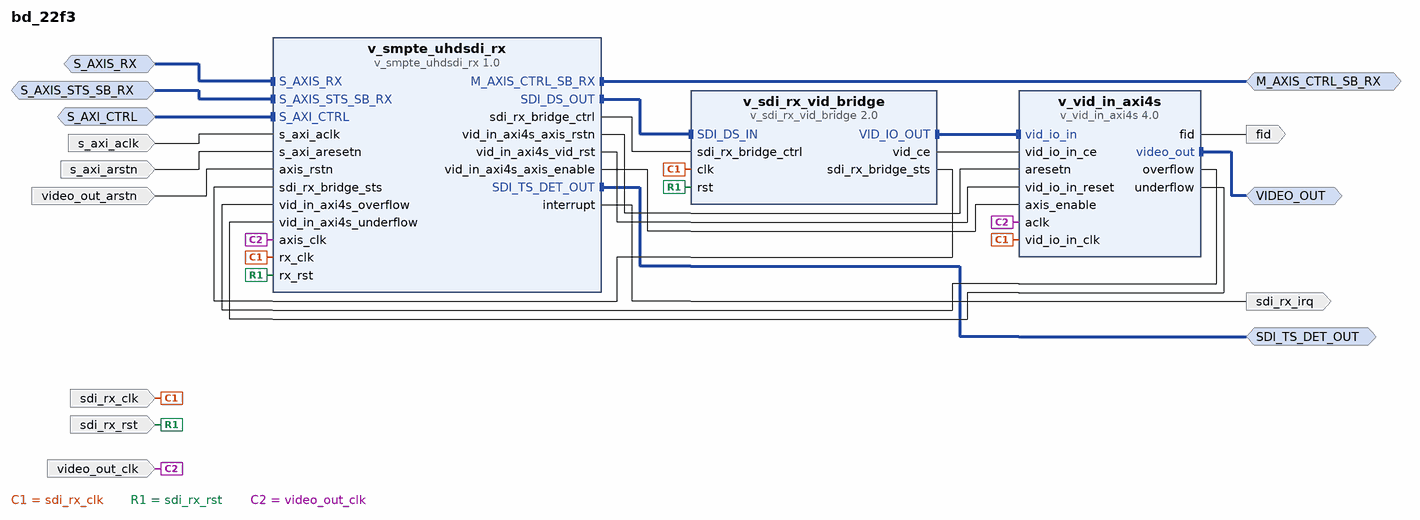
[diagram p0: block diagram of the top level]
# Vivado block design bd_22f3, xczu7ev-fbvb900-1-i, Vivado 2018.2
create_bd_design bd_22f3

create_bd_intf_port -mode Slave -vlnv xilinx.com:interface:axis_rtl:1.0 S_AXIS_RX
create_bd_intf_port -mode Master -vlnv xilinx.com:interface:axis_rtl:1.0 M_AXIS_CTRL_SB_RX
create_bd_intf_port -mode Slave -vlnv xilinx.com:interface:axis_rtl:1.0 S_AXIS_STS_SB_RX
create_bd_intf_port -mode Master -vlnv xilinx.com:interface:sdi_native_rtl:2.0 SDI_TS_DET_OUT
create_bd_intf_port -mode Master -vlnv xilinx.com:interface:axis_rtl:1.0 VIDEO_OUT
set_property -dict [list \
  CONFIG.TDATA_NUM_BYTES 8 \
  CONFIG.LAYERED_METADATA {xilinx.com:interface:datatypes:1.0 {TDATA {datatype {name {attribs {resolve_type immediate dependency {} format string minimum {} maximum {}} value xilinx.com:video:G_B_R_444:1.0} bitwidth {attribs {resolve_type automatic dependency {} format long minimum {} maximum {}} value 30} bitoffset {attribs {resolve_type immediate dependency {} format long minimum {} maximum {}} value 0} array_type {name {attribs {resolve_type immediate dependency {} format string minimum {} maximum {}} value rows} size {attribs {resolve_type generated dependency active_rows format long minimum {} maximum {}} value 1} stride {attribs {resolve_type generated dependency active_rows_stride format long minimum {} maximum {}} value 32} datatype {name {attribs {resolve_type immediate dependency {} format string minimum {} maximum {}} value {}} bitwidth {attribs {resolve_type automatic dependency {} format long minimum {} maximum {}} value 30} bitoffset {attribs {resolve_type immediate dependency {} format long minimum {} maximum {}} value 0} array_type {name {attribs {resolve_type immediate dependency {} format string minimum {} maximum {}} value cols} size {attribs {resolve_type generated dependency active_cols format long minimum {} maximum {}} value 1} stride {attribs {resolve_type generated dependency active_cols_stride format long minimum {} maximum {}} value 32} datatype {name {attribs {resolve_type immediate dependency {} format string minimum {} maximum {}} value {}} bitwidth {attribs {resolve_type automatic dependency {} format long minimum {} maximum {}} value 30} bitoffset {attribs {resolve_type immediate dependency {} format long minimum {} maximum {}} value 0} struct {field_G {name {attribs {resolve_type immediate dependency {} format string minimum {} maximum {}} value G} enabled {attribs {resolve_type immediate dependency {} format bool minimum {} maximum {}} value true} datatype {name {attribs {resolve_type immediate dependency {} format string minimum {} maximum {}} value {}} bitwidth {attribs {resolve_type generated dependency video_data_width format long minimum {} maximum {}} value 10} bitoffset {attribs {resolve_type immediate dependency {} format long minimum {} maximum {}} value 0} integer {signed {attribs {resolve_type immediate dependency {} format bool minimum {} maximum {}} value true}}}} field_B {name {attribs {resolve_type immediate dependency {} format string minimum {} maximum {}} value B} enabled {attribs {resolve_type generated dependency video_comp1_enabled format bool minimum {} maximum {}} value true} datatype {name {attribs {resolve_type immediate dependency {} format string minimum {} maximum {}} value {}} bitwidth {attribs {resolve_type generated dependency video_data_width format long minimum {} maximum {}} value 10} bitoffset {attribs {resolve_type generated dependency video_comp1_offset format long minimum {} maximum {}} value 10} integer {signed {attribs {resolve_type immediate dependency {} format bool minimum {} maximum {}} value true}}}} field_R {name {attribs {resolve_type immediate dependency {} format string minimum {} maximum {}} value R} enabled {attribs {resolve_type generated dependency video_comp2_enabled format bool minimum {} maximum {}} value true} datatype {name {attribs {resolve_type immediate dependency {} format string minimum {} maximum {}} value {}} bitwidth {attribs {resolve_type generated dependency video_data_width format long minimum {} maximum {}} value 10} bitoffset {attribs {resolve_type generated dependency video_comp2_offset format long minimum {} maximum {}} value 20} integer {signed {attribs {resolve_type immediate dependency {} format bool minimum {} maximum {}} value true}}}}}}}}}}} TDATA_WIDTH 32}} \
] [get_bd_intf_ports VIDEO_OUT]
create_bd_intf_port -mode Slave -vlnv xilinx.com:interface:aximm_rtl:1.0 S_AXI_CTRL
set_property -dict {CONFIG.DATA_WIDTH 32 CONFIG.ADDR_WIDTH 16} [get_bd_intf_ports S_AXI_CTRL]
create_bd_port -dir I -type clk sdi_rx_clk
set_property -dict {CONFIG.ASSOCIATED_RESET sdi_rx_rst} [get_bd_ports sdi_rx_clk]
create_bd_port -dir I -type rst sdi_rx_rst
create_bd_port -dir O fid
create_bd_port -dir I -type clk video_out_clk
set_property -dict {CONFIG.ASSOCIATED_RESET video_out_arstn} [get_bd_ports video_out_clk]
create_bd_port -dir I -type rst video_out_arstn
set_property -dict {CONFIG.POLARITY ACTIVE_LOW} [get_bd_ports video_out_arstn]
create_bd_port -dir O -type intr sdi_rx_irq
create_bd_port -dir I -type clk s_axi_aclk
set_property -dict {CONFIG.ASSOCIATED_RESET s_axi_arstn} [get_bd_ports s_axi_aclk]
create_bd_port -dir I -type rst s_axi_arstn
set_property -dict {CONFIG.POLARITY ACTIVE_LOW} [get_bd_ports s_axi_arstn]

create_bd_cell -type ip -vlnv xilinx.com:ip:v_smpte_uhdsdi_rx:1.0 v_smpte_uhdsdi_rx
set_property -dict [list \
  CONFIG.C_LINE_RATE 12G_SDI_8DS \
  CONFIG.C_ADV_FEATURE false \
  CONFIG.C_AXI4LITE_ENABLE true \
  CONFIG.C_INCLUDE_VID_OVER_AXI true \
  CONFIG.C_INCLUDE_SDI_BRIDGE true \
  CONFIG.C_INCLUDE_RX_EDH_PROCESSOR true \
] [get_bd_cells v_smpte_uhdsdi_rx]
create_bd_cell -type ip -vlnv xilinx.com:ip:v_sdi_rx_vid_bridge:2.0 v_sdi_rx_vid_bridge
set_property -dict [list \
  CONFIG.C_PIXELS_PER_CLOCK 2 \
  CONFIG.C_INCLUDE_3G_SDI_BRIDGE true \
  CONFIG.C_INCLUDE_12G_SDI_BRIDGE true \
] [get_bd_cells v_sdi_rx_vid_bridge]
create_bd_cell -type ip -vlnv xilinx.com:ip:v_vid_in_axi4s:4.0 v_vid_in_axi4s
set_property -dict [list \
  CONFIG.C_PIXELS_PER_CLOCK 2 \
  CONFIG.C_M_AXIS_VIDEO_DATA_WIDTH 10 \
  CONFIG.C_NATIVE_COMPONENT_WIDTH 10 \
  CONFIG.C_HAS_ASYNC_CLK 1 \
] [get_bd_cells v_vid_in_axi4s]

# ---- connections ----

connect_bd_intf_net [get_bd_intf_pins v_sdi_rx_vid_bridge/SDI_DS_IN] [get_bd_intf_pins v_smpte_uhdsdi_rx/SDI_DS_OUT]
connect_bd_intf_net [get_bd_intf_pins v_sdi_rx_vid_bridge/VID_IO_OUT] [get_bd_intf_pins v_vid_in_axi4s/vid_io_in]
connect_bd_intf_net [get_bd_intf_ports S_AXIS_RX] [get_bd_intf_pins v_smpte_uhdsdi_rx/S_AXIS_RX]
connect_bd_intf_net [get_bd_intf_ports M_AXIS_CTRL_SB_RX] [get_bd_intf_pins v_smpte_uhdsdi_rx/M_AXIS_CTRL_SB_RX]
connect_bd_intf_net [get_bd_intf_ports S_AXIS_STS_SB_RX] [get_bd_intf_pins v_smpte_uhdsdi_rx/S_AXIS_STS_SB_RX]
connect_bd_intf_net [get_bd_intf_ports SDI_TS_DET_OUT] [get_bd_intf_pins v_smpte_uhdsdi_rx/SDI_TS_DET_OUT]
connect_bd_intf_net [get_bd_intf_ports VIDEO_OUT] [get_bd_intf_pins v_vid_in_axi4s/video_out]
connect_bd_intf_net [get_bd_intf_ports S_AXI_CTRL] [get_bd_intf_pins v_smpte_uhdsdi_rx/S_AXI_CTRL]
connect_bd_net [get_bd_ports sdi_rx_clk] \
  [get_bd_pins v_smpte_uhdsdi_rx/rx_clk] [get_bd_pins v_sdi_rx_vid_bridge/clk] [get_bd_pins v_vid_in_axi4s/vid_io_in_clk]
connect_bd_net [get_bd_ports sdi_rx_rst] [get_bd_pins v_smpte_uhdsdi_rx/rx_rst] [get_bd_pins v_sdi_rx_vid_bridge/rst]
connect_bd_net [get_bd_ports s_axi_aclk] [get_bd_pins v_smpte_uhdsdi_rx/s_axi_aclk]
connect_bd_net [get_bd_ports s_axi_arstn] [get_bd_pins v_smpte_uhdsdi_rx/s_axi_aresetn]
connect_bd_net [get_bd_pins v_smpte_uhdsdi_rx/interrupt] [get_bd_ports sdi_rx_irq]
connect_bd_net [get_bd_pins v_smpte_uhdsdi_rx/sdi_rx_bridge_ctrl] [get_bd_pins v_sdi_rx_vid_bridge/sdi_rx_bridge_ctrl]
connect_bd_net [get_bd_pins v_sdi_rx_vid_bridge/sdi_rx_bridge_sts] [get_bd_pins v_smpte_uhdsdi_rx/sdi_rx_bridge_sts]
connect_bd_net [get_bd_ports video_out_clk] [get_bd_pins v_smpte_uhdsdi_rx/axis_clk] [get_bd_pins v_vid_in_axi4s/aclk]
connect_bd_net [get_bd_ports video_out_arstn] [get_bd_pins v_smpte_uhdsdi_rx/axis_rstn]
connect_bd_net [get_bd_pins v_vid_in_axi4s/overflow] [get_bd_pins v_smpte_uhdsdi_rx/vid_in_axi4s_overflow]
connect_bd_net [get_bd_pins v_vid_in_axi4s/underflow] [get_bd_pins v_smpte_uhdsdi_rx/vid_in_axi4s_underflow]
connect_bd_net [get_bd_pins v_smpte_uhdsdi_rx/vid_in_axi4s_axis_rstn] [get_bd_pins v_vid_in_axi4s/aresetn]
connect_bd_net [get_bd_pins v_smpte_uhdsdi_rx/vid_in_axi4s_vid_rst] [get_bd_pins v_vid_in_axi4s/vid_io_in_reset]
connect_bd_net [get_bd_pins v_smpte_uhdsdi_rx/vid_in_axi4s_axis_enable] [get_bd_pins v_vid_in_axi4s/axis_enable]
connect_bd_net [get_bd_pins v_sdi_rx_vid_bridge/vid_ce] [get_bd_pins v_vid_in_axi4s/vid_io_in_ce]
connect_bd_net [get_bd_pins v_vid_in_axi4s/fid] [get_bd_ports fid]

# ---- address map ----
assign_bd_address -offset 0x0000 -range 64K -target_address_space [get_bd_addr_spaces S_AXI_CTRL] [get_bd_addr_segs v_smpte_uhdsdi_rx/S_AXI_CTRL/Reg]

validate_bd_design
save_bd_design
